# EAGLE design HM-10 Breakout (EAGLE 6.5.0)
HM-10 Breakout
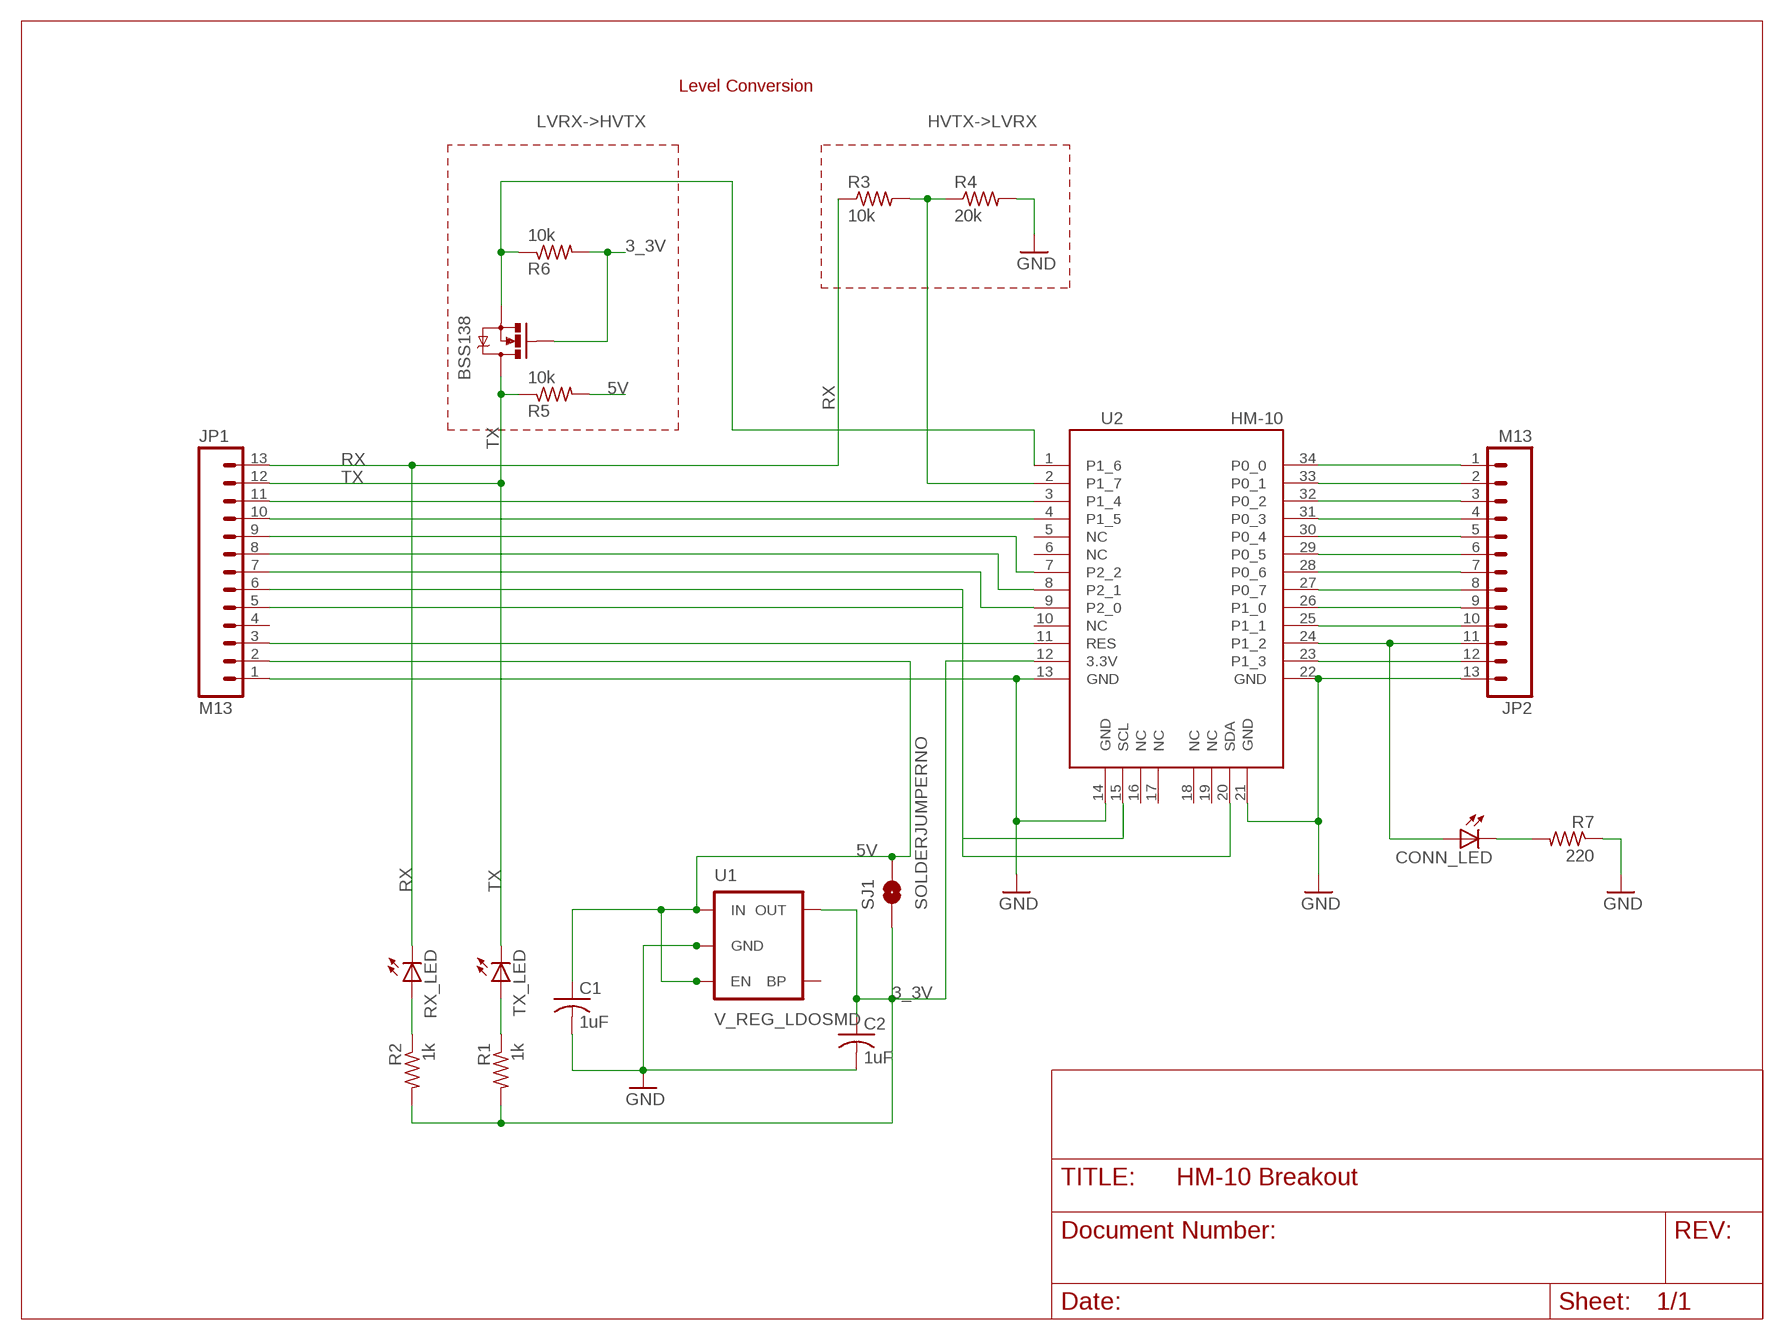
[diagram p0: schematic, sheet 1]

## Parts
BSS138  MOSFET-NCHANNELSMD  [SOT23-3]
C1  1uF  C-USC0805K  [C0805K]
C2  1uF  C-USC0805K  [C0805K]
CONN_LED  LED0603  [LED-0603]
JP1  M13  [1X13]
JP2  M13  [1X13]
R1  1k  R-US_M0805  [M0805]
R2  1k  R-US_M0805  [M0805]
R3  10k  R-US_M0805  [M0805]
R4  20k  R-US_M0805  [M0805]
R5  10k  R-US_M0805  [M0805]
R6  10k  R-US_M0805  [M0805]
R7  220  R-US_M0805  [M0805]
RX_LED  LED0603  [LED-0603]
SJ1  SOLDERJUMPERNO  [SJ_2S-NO]
TX_LED  LED0603  [LED-0603]
U1  V_REG_LDOSMD  [SOT23-5]
U2  HM-10  [HM-10]

## Nets
3_3V: BSS138.1(G) C2.1 R1.2 R2.2 R6.2 SJ1.1 U1.5(OUT) U2.12(3.3V)
5V: C1.1 JP1.2 R5.2 SJ1.2 U1.1(IN) U1.3(EN)
GND: C1.2 C2.2 JP1.1 JP2.13 R4.2 R7.1 U1.2(GND) U2.13(GND) U2.14(GND) U2.21(GND) U2.22(GND)
HVTX->LVRX: R3.2 R4.1 U2.2(P1_7)
LVRX->HVTX: BSS138.2(S) R6.1 U2.1(P1_6)
N$2: CONN_LED.A JP2.11 U2.24(P1_2)
N$3: JP1.3 U2.11(RES)
N$4: JP1.5 U2.15(SCL)
N$5: JP1.9 U2.7(P2_2)
N$6: JP1.8 U2.8(P2_1)
N$7: JP1.7 U2.9(P2_0)
N$8: JP2.10 U2.25(P1_1)
N$9: JP1.6 U2.20(SDA)
N$10: JP1.10 U2.4(P1_5)
N$11: JP1.11 U2.3(P1_4)
N$14: JP2.9 U2.26(P1_0)
N$15: JP2.8 U2.27(P0_7)
N$16: JP2.7 U2.28(P0_6)
N$17: JP2.6 U2.29(P0_5)
N$18: JP2.5 U2.30(P0_4)
N$19: JP2.4 U2.31(P0_3)
N$20: JP2.3 U2.32(P0_2)
N$21: JP2.2 U2.33(P0_1)
N$22: JP2.1 U2.34(P0_0)
N$23: JP2.12 U2.23(P1_3)
N$24: R1.1 TX_LED.A
N$26: CONN_LED.C R7.2
N$27: R2.1 RX_LED.A
RX: JP1.13 R3.1 RX_LED.C
TX: BSS138.3(D) JP1.12 R5.1 TX_LED.C
Unconnected: JP1.4 U1.4(BP) U2.5(NC) U2.6(NC) U2.10(NC) U2.16(NC) U2.17(NC) U2.18(NC) U2.19(NC)

## Notes on the sheet
- Level Conversion

## Library data of the parts
BSS138 = SparkFun:MOSFET-NCHANNEL
C1 C2 = resistor:C-US: CAPACITOR, American symbol
CONN_LED RX_LED TX_LED = SparkFun:LED: LEDs Standard schematic elements and footprints for 5mm, 3mm, 1206, and 0603 sized LEDs. 5mm - Spark Fun Electronics SKU : COM-00529 (and others)
JP1 JP2 = SparkFun:M13
R1-R7 = resistor:R-US_: RESISTOR, American symbol
SJ1 = SparkFun:SOLDERJUMPER: Solder Jumper Standard SMD solder jumper. Used to automate production. Two varients : Normally Open and Normally Closed are the same, but have different paste layers. NC will have a large amount of paste and should jumper during reflow.
U1 = SparkFun:V_REG_LDO: Voltage Regulator LDO Standard 150mA LDO voltage regulator in SOT-23 layout. Micrel part MIC5205. BP (by-pass) pin is used to lower output noise with 470pF cap.
U2 = HM-10_BLE:HM-10

## Board
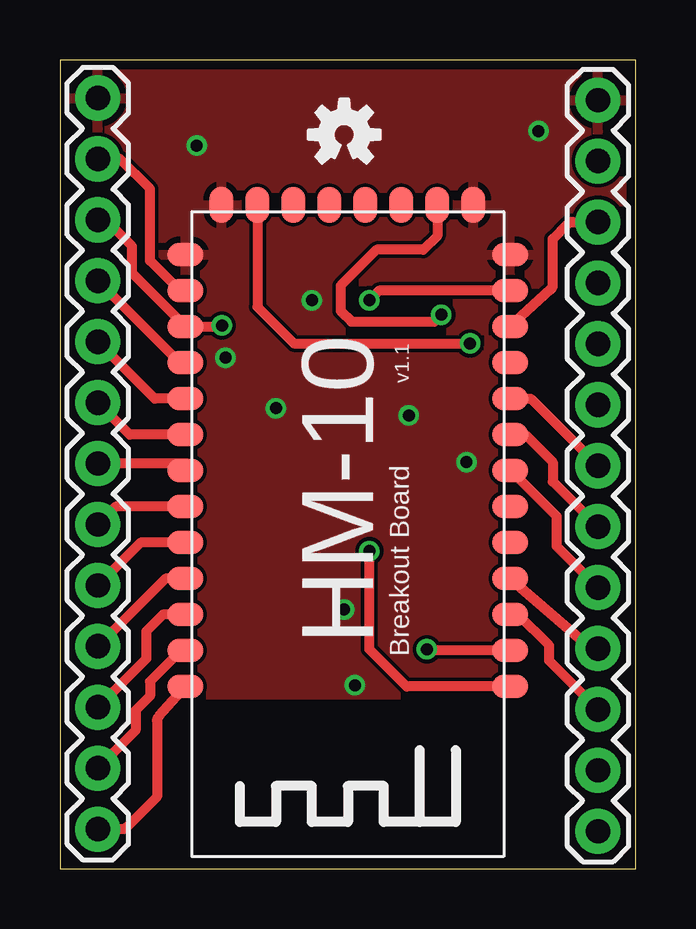
[diagram p1: board, top side]
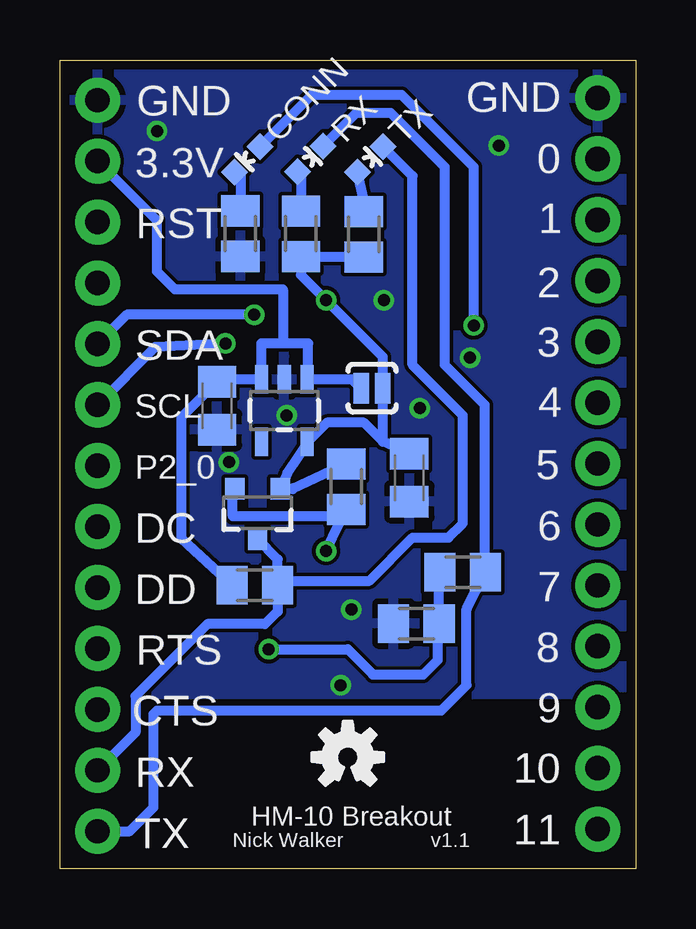
[diagram p2: board, bottom side, seen from below]

Size 24 x 33.72 mm. Coordinates in mm from the lower left corner, seen from the top.
Outline: 0,0 24,0 24,33.72 0,33.72 0,0
Copper layers (1*16): Top 0.0356mm / dielectric 1.5011mm / Bottom 0.0356mm
Design rules "LaenPCBOrder *": minimum track width 6mil, minimum drill 13mil, track to track 6mil, track to pad 6mil, pad to pad 6mil, via to via 6mil, smd to smd 6mil, copper to edge 15mil, drill to drill 6mil, minimum pad ring 7mil, minimum via ring 7mil, stop-mask expansion 4mil, vias tented up to drill 25mil, thermal gap 10mil

### Footprints (pad centres in the part's own frame; a part is rotated, then mirrored left to right if it is on the bottom)
SOT23-3 = smd 0.8 x 0.9: 1 -0.95,-1; 2 0.95,-1; 3 0,1.1
C0805K = smd 1.3 x 1.6: 1 -1,0; 2 1,0
LED-0603 = smd 0.8 x 0.8: A 0,-0.75; C 0,0.75
1X13 = drill 1.016 pad 1.88: 1 0,0; 2 2.54,0; 3 5.08,0; 4 7.62,0; 5 10.16,0; 6 12.7,0; 7 15.24,0; 8 17.78,0; 9 20.32,0; 10 22.86,0; 11 25.4,0; 12 27.94,0; 13 30.48,0
M0805 = smd 1.3 x 1.6: 1 -0.95,0; 2 0.95,0
SJ_2S-NO = smd 0.635 x 1.27: 1 -0.45,0; 2 0.45,0
SOT23-5 = smd 0.55 x 1.2: 1 -0.95,-1.3; 2 0,-1.3; 3 0.95,-1.3; 4 0.95,1.3; 5 -0.95,1.3
HM-10 = smd 1.5 x 1: 1 -6.77,6.35; 2 -6.77,4.85; 3 -6.77,3.35; 4 -6.77,1.85; 5 -6.77,0.35; 6 -6.77,-1.15; 7 -6.77,-2.65; 8 -6.77,-4.15; 9 -6.77,-5.65; 10 -6.77,-7.15; 11 -6.77,-8.65; 12 -6.77,-10.15; 13 -6.77,-11.65; 22 6.77,-11.65; 23 6.77,-10.15; 24 6.77,-8.65; 25 6.77,-7.15; 26 6.77,-5.65; 27 6.77,-4.15; 28 6.77,-2.65; 29 6.77,-1.15; 30 6.77,0.35; 31 6.77,1.85; 32 6.77,3.35; 33 6.77,4.85; 34 6.77,6.35 | smd 1 x 1.5: 14 -5.23,-13.72; 15 -3.73,-13.72; 16 -2.23,-13.72; 17 -0.73,-13.72; 18 0.77,-13.72; 19 2.27,-13.72; 20 3.77,-13.72; 21 5.27,-13.72

### Placement (x,y rotation side)
BSS138  15.76,14.84 180 bottom
C1  17.45,19.3 270 bottom
C2  9.43,16.3 270 bottom
CONN_LED  16.19,29.57 135 bottom
JP1  22.43,32.04 270 top
JP2  1.58,1.65 90 top
R1  11.33,26.45 270 bottom
R2  13.95,26.47 270 bottom
R3  7.2,12.37 180 bottom
R4  9.14,10.22 180 bottom
R5  15.88,11.82 180 bottom
R6  12.07,15.93 90 bottom
R7  16.48,26.48 90 bottom
RX_LED  13.56,29.59 315 bottom
SJ1  10.99,20.03 180 bottom
TX_LED  11.06,29.57 315 bottom
U1  14.65,19.1 180 bottom
U2  12,13.95 180 top
U$1  [OSHW-LOGO-S]  12,4.65 0 bottom
U$2  [OSHW-LOGO-S]  11.85,30.6 0 top

### Tracks (layer width: path | path; a pad name or v marks a point on that pad's centre or on a via)
3_3V  (via drill 0.5)
  Top 0.406: U2.12 13.3,24.1 v12.9,23.7
  Bottom 0.406: 13.6,17.87 arc45 13.78,17.8 U1.5 | R6.2 14.3,15.83 | 14.3,15.83 14.3,15.85 | v12.9,23.7 12,22.8 | 13.93,25.95 R2.2 | 13.6,17.87 14.51,16.51 BSS138.1 14.31,15.84 14.3,15.83 | 13.6,17.87 12.87,18.6 11.33,18.6 10.54,17.81 | v12.9,23.7 10.54,21.34 SJ1.1 10.54,17.81 | R1.2 13.93,25.5 R2.2 | R2.2 13.95,24.75 v12.9,23.7 | C2.1 10.54,17.81
5V
  Bottom 0.406: 21.85,29.5 JP1.2 19.95,27.02 19.95,24.9 19.2,24.15 14.7,24.15 14.7,21.9 | 14.7,21.9 13.65,21.9 13.65,20.4 U1.1 11.8,20.4 SJ1.2 | 14.7,21.9 15.6,21.9 U1.3 17.35,20.4 C1.1 18.93,18.82 18.93,13.77 R5.2
GND  (via drill 0.5, 0.5 pad 0.25)
  other vias: 5.7,30.15 19.95,30.75 14.55,18.9 16.95,16.95 11.85,10.8 9,19.2 6.9,21.3 10.5,23.7 12.3,7.65
  pour Bottom: -0.51,7.27 24.49,7.27 24.34,34.19 -0.51,34.19
  pour Top: -0.1,33.8 -0.1,7.28 24.15,7.28 24.15,33.8
HVTX->LVRX  (via drill 0.5)
  Top 0.406: U2.2 15.35,9.1 v15.3,9.15
  Bottom 0.406: v15.3,9.15 12,9.15 10.95,8.1 8.85,8.1 8.25,8.7 8.25,10.16 R4.1 8.19,12.33 R3.2
LVRX->HVTX  (via drill 0.5)
  Top 0.406: U2.1 14.45,7.6 12.9,9.15 v12.9,13.25
  Bottom 0.406: v12.9,13.25 R6.1 12.35,14.7 16.8,14.7 16.8,15.75 BSS138.2
N$2  (via drill 0.5)
  Top 0.406: JP2.11 1.9,27.05 3,25.95 3,24.83 U2.24 6.7,22.6 v6.75,22.65
  Bottom 0.406: v6.75,22.65 6.75,29.25 9.75,32.25 13.51,32.25 CONN_LED.A
N$3
  Top 0.406: U2.11 20.48,24.16 arc45 20.55,24.34 20.55,26.25 21.19,26.89 arc-45 21.37,26.96 JP1.3
N$4  (via drill 0.5)
  Top 0.406: U2.15 15.73,26.38 15.15,25.8 13.2,25.8 11.7,24.3 11.7,23.25 12.15,22.8 15.6,22.8 v15.9,23.1
  Bottom 0.406: v15.9,23.1 21.21,23.1 JP1.5
N$5
  Top 0.406: U2.7 18.8,16.6 20.7,14.7 20.7,13.45 JP1.9
N$6
  Top 0.406: U2.8 19.4,18.1 20.55,16.95 20.55,16.14 JP1.8
N$7
  Top 0.406: U2.9 19.63,19.6 JP1.7
N$8
  Top 0.406: U2.25 4.99,21.1 JP2.10
N$9  (via drill 0.5)
  Top 0.406: U2.20 8.23,23.42 9.75,21.9 v17.1,21.9 17.25,21.9
  Bottom 0.406: v17.1,21.9 20.02,21.75 JP1.6
N$10
  Top 0.406: U2.4 22.07,9.26 arc45 22.25,9.18 JP1.10
N$11
  Top 0.406: JP1.11 20.4,8.67 20.4,9.3 19.1,10.6 U2.3
N$14
  Top 0.406: U2.26 3.95,19.6 JP2.9
N$15
  Top 0.406: U2.27 2.91,18.1 JP2.8
N$16
  Top 0.406: U2.28 5.46,16.82 arc45 5.28,16.89 JP2.7
N$17
  Top 0.406: U2.29 2.33,15.1 JP2.6
N$18
  Top 0.406: U2.30 3.37,13.6 JP2.5
N$19
  Top 0.406: U2.31 4.41,12.1 JP2.4
N$20
  Top 0.406: 1.62,6.84 arc45 JP2.3 3.6,8.75 3.6,9.9 4.3,10.6 U2.32
N$21
  Top 0.406: U2.33 5.05,9.1 3.75,7.8 3.75,7.2 3.15,6.6 3.15,5.76 JP2.2
N$22
  Top 0.406: U2.34 4.12,6.34 arc45 4.05,6.17 4.05,3 2.77,1.73 arc-45 2.6,1.65 JP2.1
N$23
  Top 0.406: U2.23 5,24.1 3.75,25.35 3.75,28.35 2.51,29.59 JP2.12
N$24
  Bottom 0.406: R1.1 11.21,27.4 TX_LED.A
N$26
  Bottom 0.406: CONN_LED.C 16.48,28.97 R7.2
N$27
  Bottom 0.406: RX_LED.A 13.95,28.99 R2.1
RX
  Bottom 0.406: JP1.13 21.09,1.56 20.1,2.55 20.1,6.45 19.95,6.6 8.1,6.6 7.05,7.65 7.05,10.82 R3.1 6.3,12.41 6.3,19.35 7.95,21 7.95,29.25 10.2,31.5 11.66,31.5 RX_LED.C
TX
  Bottom 0.406: JP1.12 20.85,5.68 20.85,7.2 17.85,10.2 15.45,10.2 14.93,10.72 R5.1 | R5.1 14.75,12 11.1,12 9.3,13.8 7.8,13.8 7.2,14.4 7.2,18.9 9.3,21 9.3,28.87 TX_LED.C | R5.1 14.93,12.9 BSS138.3

### Text on the board
tNames: v1.1 | Breakout Board
bNames: GND | GND | 0 | TX | RX | CONN | 3.3V | 1 | RST | 2 | 3 | SDA | 4 | SCL | 5 | P2_0 | 6 | DC | 7 | DD | 8 | RTS | 9 | CTS | 10 | RX | 11 | HM-10 Breakout | v1.1 | Nick Walker | TX